# EasyEDA schematic SCH_Batteries-Recharger_2025-04-03.json
TITLE: Sheet_1; REV: 1.0; Date: 2025-03-29; Sheet: 1/1; Drawn By: budij; Company: Your Company
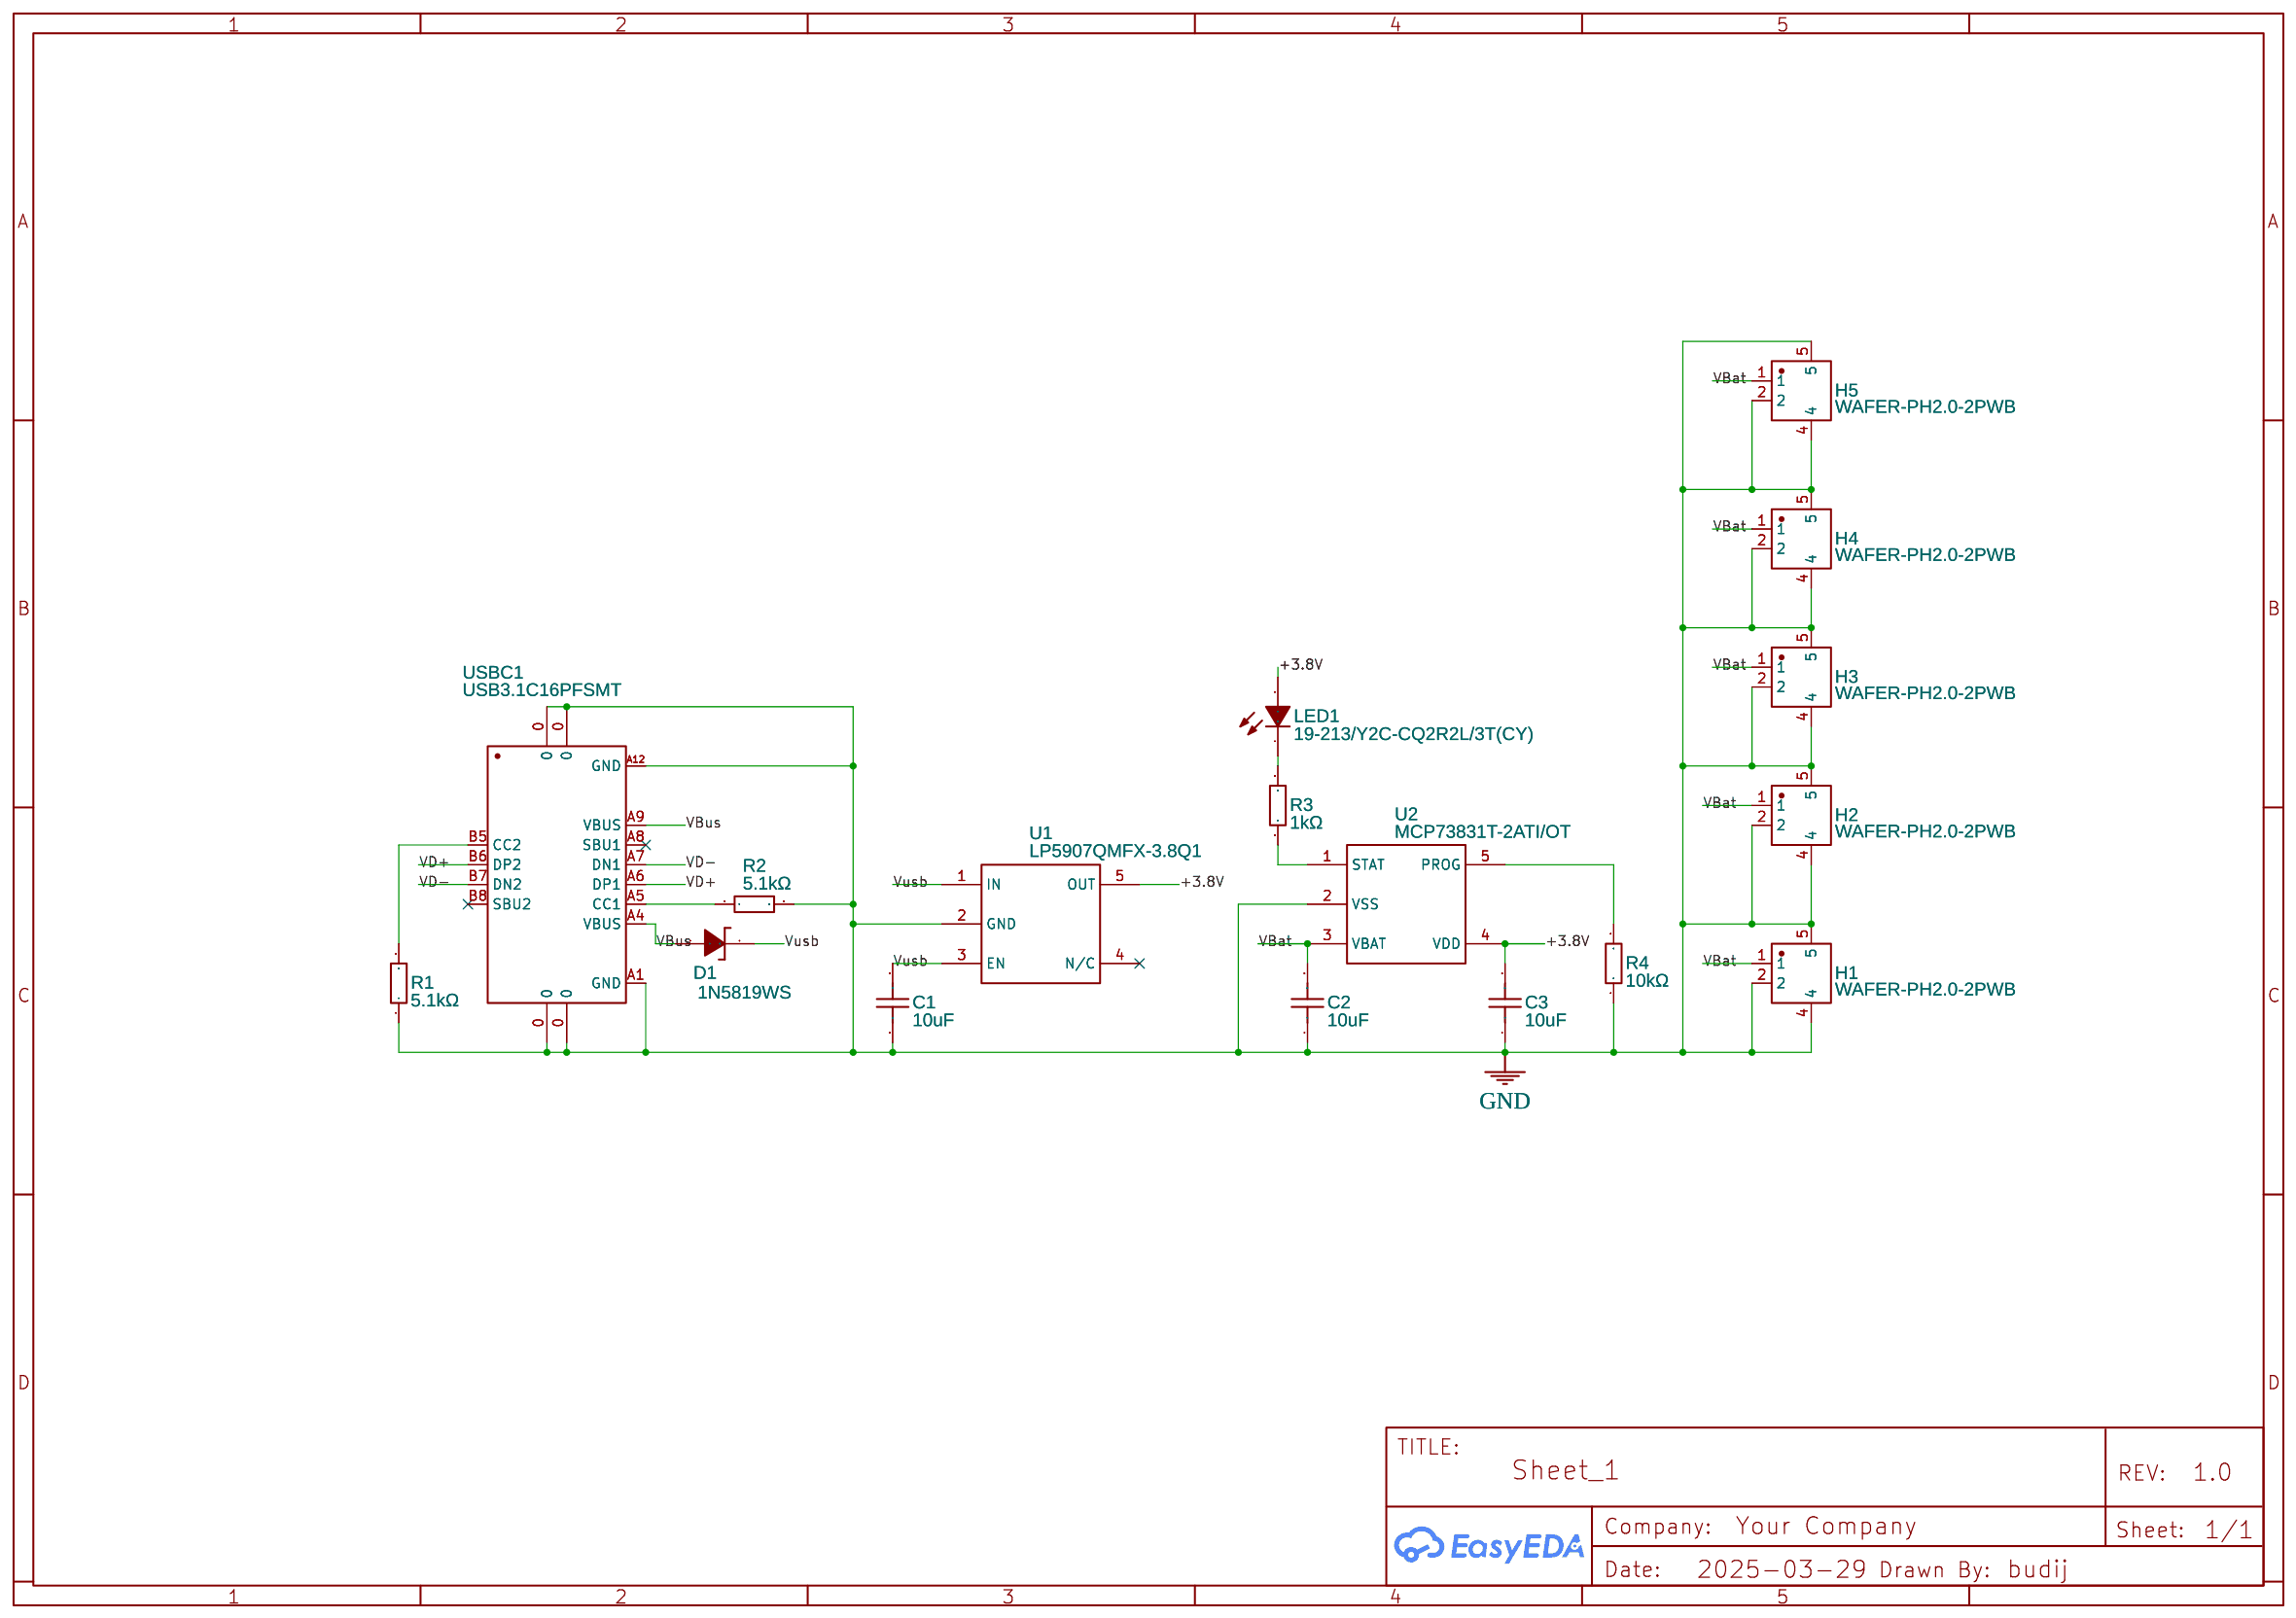
[diagram p0: schematic sheet]

## Parts
C1  10uF  [C0603]
C2  10uF  [C0603]
C3  10uF  [C0603]
D1  1N5819WS  [SOD-323_L1.8-W1.3-LS2.5-RD]
H1  WAFER-PH2.0-2PWB  [CONN-SMD_2P-P2.00_XUNPU_WAFER-PH2.0-2PWB]
H2  WAFER-PH2.0-2PWB  [CONN-SMD_2P-P2.00_XUNPU_WAFER-PH2.0-2PWB]
H3  WAFER-PH2.0-2PWB  [CONN-SMD_2P-P2.00_XUNPU_WAFER-PH2.0-2PWB]
H4  WAFER-PH2.0-2PWB  [CONN-SMD_2P-P2.00_XUNPU_WAFER-PH2.0-2PWB]
H5  WAFER-PH2.0-2PWB  [CONN-SMD_2P-P2.00_XUNPU_WAFER-PH2.0-2PWB]
LED1  19-213/Y2C-CQ2R2L/3T(CY)  [LED0603-RD-YELLOW]
R1  5.1kΩ  [R0603]
R2  5.1kΩ  [R0603]
R3  1kΩ  [R0603]
R4  10kΩ  [R0603]
U1  LP5907QMFX-3.8Q1  [SOT-23-5_L3.0-W1.7-P0.95-LS2.8-BL]
U2  MCP73831T-2ATI/OT  [SOT-23-5_L3.0-W1.7-P0.95-LS2.8-BR]
USBC1  USB3.1C16PFSMT  [USB-C-SMD_TYPE-C-USB-17]

## Library data of the parts
C1-C3 = CL10A106KP8NNNC: Supplier: LCSC; Manufacturer: SAMSUNG(三星); Supplier Part: C19702; JLCPCB Part Class: Basic Part
D1 = 1N5819WS: Supplier: LCSC; Supplier Part: C191023; Manufacturer: Hottech(合科泰); Contributor: LCSC; JLCPCB Part Class: Basic Part
H1-H5 = WAFER-PH2.0-2PWB: Supplier: LCSC; Supplier Part: C3029440; Manufacturer: XUNPU(讯普); link: https://atta.szlcsc.com/upload/public/pdf/source/20220527/83903C18429EFE4C9EEE8C529A248431.pdf; Contributor: lcsc; JLCPCB Part Class: Extended Part
LED1 = 19-213/Y2C-CQ2R2L/3T(CY): Supplier: LCSC; Manufacturer: EVERLIGHT(亿光); Supplier Part: C72038; JLCPCB Part Class: Basic Part; link: https://lcsc.com/eda_search?q=C72038&%26type=1&ref=editor
R1 R2 = 0603WAF5101T5E: Supplier: LCSC; Manufacturer: UNI-ROYAL(厚声); Supplier Part: C23186; JLCPCB Part Class: Basic Part
R3 = 0603WAF1001T5E: Supplier: LCSC; Manufacturer: UNI-ROYAL(厚声); Supplier Part: C21190; Resistance (Ohms): 1K; JLCPCB Part Class: Basic Part
R4 = 0603WAF1002T5E: Supplier: LCSC; Manufacturer: UNI-ROYAL(厚声); Supplier Part: C25804; JLCPCB Part Class: Basic Part; link: https://lcsc.com/eda_search?q=C25804&%26type=1&ref=editor
U1 = LP5907QMFX-3.8Q1: Contributor: LCSC; Supplier: LCSC; Manufacturer: TI(德州仪器); Supplier Part: C132035; JLCPCB Part Class: Extended Part; link: https://lcsc.com/eda_search?q=C132035&%26type=1&ref=editor
U2 = MCP73831T-2ATI/OT: Supplier: LCSC; Manufacturer: MICROCHIP; Supplier Part: C14879; JLCPCB Part Class: Extended Part
USBC1 = USB3.1C16PFSMT: Supplier: LCSC; Supplier Part: C167321; Manufacturer: LCSC; Contributor: LCSC; JLCPCB Part Class: Extended Part

## Nets
+3.8V: C3.2 LED1.2(A) U1.5(OUT) U2.4(VDD)
GND: C1.1 C2.1 C3.1 H1.2 H1.4 H1.5 H2.2 H2.4 H2.5 H3.2 H3.4 H3.5 H4.2 H4.4 H4.5 H5.2 H5.4 H5.5 R1.1 R2.2 R4.1 U1.2(GND) U2.2(VSS) USBC1.0 USBC1.A1(GND) USBC1.A12(GND)
VBat: C2.2 H1.1 H2.1 H3.1 H4.1 H5.1 U2.3(VBAT)
VBus: D1.2(A) USBC1.A4(VBUS) USBC1.A9(VBUS)
VD+: USBC1.A6(DP1) USBC1.B6(DP2)
VD-: USBC1.A7(DN1) USBC1.B7(DN2)
Vusb: C1.2 D1.1(C) U1.1(IN) U1.3(EN)
Net-(LED1-1): LED1.1(C) R3.2
Net-(R1-2): R1.2 USBC1.B5(CC2)
Net-(R2-1): R2.1 USBC1.A5(CC1)
Net-(R3-1): R3.1 U2.1(STAT)
Net-(R4-2): R4.2 U2.5(PROG)

Not connected (* = marked no-connect by the designer): U1 4(N/C)*; USBC1 A8(SBU1)* B8(SBU2)*
